# Altium schematic sheet ESP32_S3.SchDoc
size A3; SheetNumber: 1; SheetTotal: 2
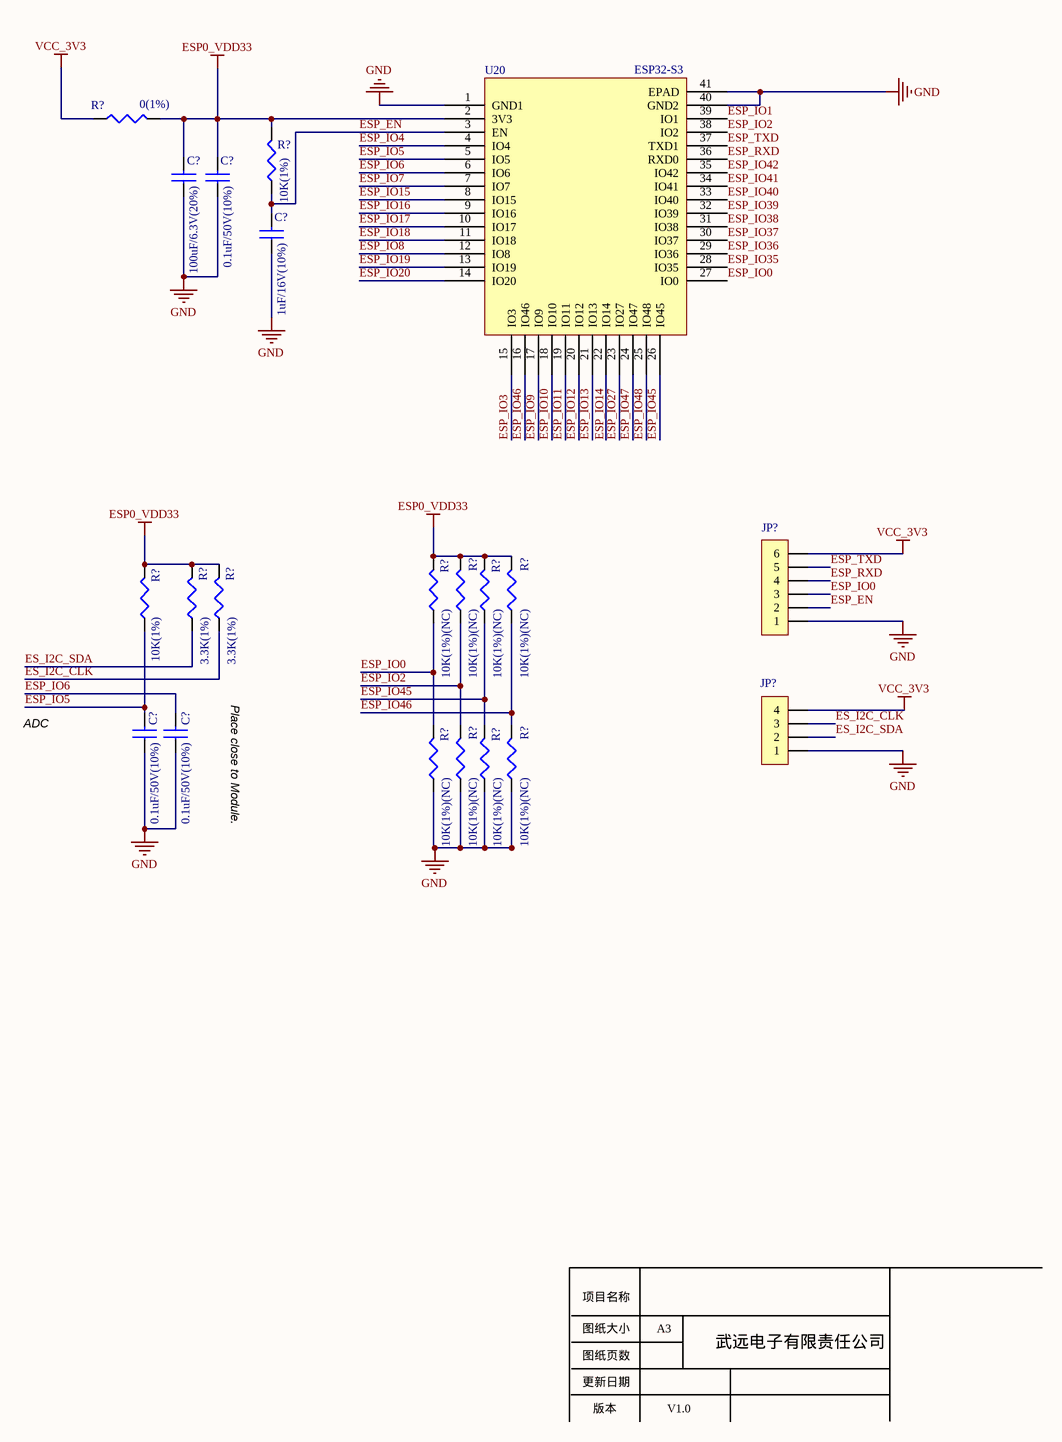
[diagram p0: ESP32_S3.SchDoc]

## Parts
(Parts that share a designator on the sheet are numbered #1, #2 ... from top to bottom, then left to right.)
C?#1  100uF/6.3V(20%)  [SC0805]
C?#2  0.1uF/50V(10%)  [SC0805]
C?#3  1uF/16V(10%)  [SC0805]
C?#4  0.1uF/50V(10%)  [SC0805]
C?#5  0.1uF/50V(10%)  [SC0805]
JP?#1  HDR-1X6  [XH2.54-WI-6P]  (value not drawn)
JP?#2  HDR-1X4  [XH2.54-WI-4P]  (value not drawn)
R?#1  0(1%)  [SR0603]
R?#2  10K(1%)  [SR0603]
R?#3  10K(1%)(NC)  [SR0603]
R?#4  10K(1%)(NC)  [SR0603]
R?#5  10K(1%)(NC)  [SR0603]
R?#6  10K(1%)(NC)  [SR0603]
R?#7  10K(1%)  [SR0603]
R?#8  3.3K(1%)  [SR0603]
R?#9  3.3K(1%)  [SR0603]
R?#10  10K(1%)(NC)  [SR0603]
R?#11  10K(1%)(NC)  [SR0603]
R?#12  10K(1%)(NC)  [SR0603]
R?#13  10K(1%)(NC)  [SR0603]
U20  ESP32-S3

## Nets
ESP0_VDD33: C?#1.2 C?#2.2 R?#1.2 R?#2.2 R?#3.2 R?#4.2 R?#5.2 R?#6.2 R?#7.2 R?#8.2 R?#9.2 U20.2(3V3)
GND: C?#1.1 C?#2.1 C?#3.1 C?#4.1 C?#5.1 JP?#1.1 JP?#2.1 R?#10.1 R?#11.1 R?#12.1 R?#13.1 U20.1(GND1) U20.40(GND2) U20.41(EPAD)
VCC_3V3: JP?#1.6 JP?#2.4 R?#1.1
ES_I2C_CLK: JP?#2.3 R?#9.1
ES_I2C_SDA: JP?#2.2 R?#8.1
ESP_EN: C?#3.2 JP?#1.2 R?#2.1 U20.3(EN)
ESP_IO0: JP?#1.3 R?#3.1 R?#10.2 U20.27(IO0)
ESP_IO1: U20.39(IO1)
ESP_IO2: R?#4.1 R?#11.2 U20.38(IO2)
ESP_IO3: U20.15(IO3)
ESP_IO4: U20.4(IO4)
ESP_IO5: C?#4.2 R?#7.1 U20.5(IO5)
ESP_IO6: C?#5.2 U20.6(IO6)
ESP_IO7: U20.7(IO7)
ESP_IO8: U20.12(IO8)
ESP_IO9: U20.17(IO9)
ESP_IO10: U20.18(IO10)
ESP_IO11: U20.19(IO11)
ESP_IO12: U20.20(IO12)
ESP_IO13: U20.21(IO13)
ESP_IO15: U20.8(IO15)
ESP_IO16: U20.9(IO16)
ESP_IO17: U20.10(IO17)
ESP_IO18: U20.11(IO18)
ESP_IO19: U20.13(IO19)
ESP_IO20: U20.14(IO20)
ESP_IO27: U20.23(IO27)
ESP_IO35: U20.28(IO35)
ESP_IO36: U20.29(IO36)
ESP_IO37: U20.30(IO37)
ESP_IO38: U20.31(IO38)
ESP_IO39: U20.32(IO39)
ESP_IO40: U20.33(IO40)
ESP_IO41: U20.34(IO41)
ESP_IO42: U20.35(IO42)
ESP_IO45: R?#5.1 R?#12.2 U20.26(IO45)
ESP_IO46: R?#6.1 R?#13.2 U20.16(IO46)
ESP_IO47: U20.24(IO47)
ESP_IO48: U20.25(IO48)
ESP_RXD: JP?#1.4 U20.36(RXD0)
ESP_TXD: JP?#1.5 U20.37(TXD1)

Not connected (* = marked no-connect by the designer): U20 22(IO14)

## Notes on the sheet
- ADC
- (near C?#5) Place close to Module.
- 项目名称
- 图纸大小
- A3
- 更新日期
- 图纸页数
- 武远电子有限责任公司
- 版本
- V1.0
- Labels drawn without touching a wire or pin: ESP_IO14

## Library data of the parts
C?#1-C?#5 = CAP NP
JP?#1 = Header 6: 6P接插件; 版权归属: 源创客; BOM名称: 6P接插件; 学习资源: www.ooocke.com
JP?#2 = Header 4: 4P接插件; 版权归属: 源创客; BOM名称: 4P接插件; 学习资源: www.ooocke.com
R?#1-R?#13 = RESISTOR